# EAGLE design LMP2011basedV2 (EAGLE 8.5.1)
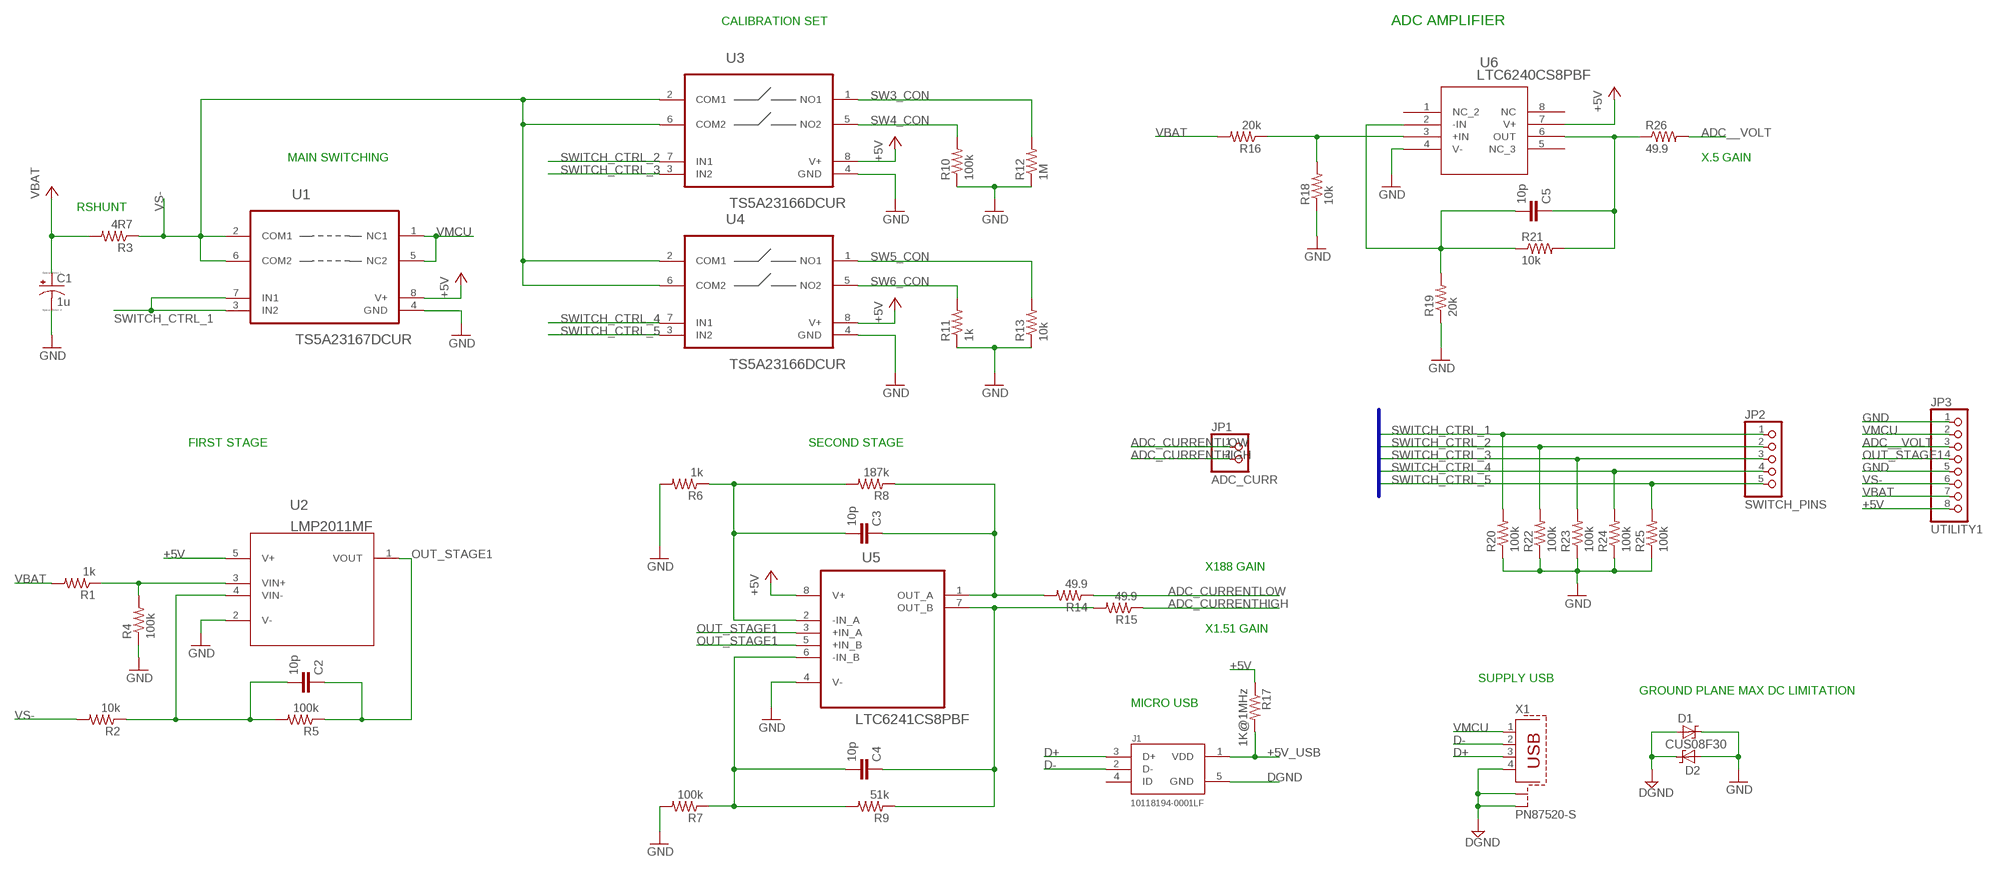
[diagram p0: schematic, sheet 1]

## Parts
C1  1u  CPOL-USB  [PANASONIC_B]
C2  10p  C-EUC0805  [C0805]
C3  10p  C-EUC0805  [C0805]
C4  10p  C-EUC0805  [C0805]
C5  10p  C-EUC0805  [C0805]
D1  CUS08F30  [SOD323]
D2  CUS08F30  [SOD323]
J1  10118194-0001LF  [FRAMATOME_10118194-0001LF]
JP1  ADC_CURR  PINHD-1X2  [1X02]
JP2  SWITCH_PINS  PINHD-1X5  [1X05]
JP3  UTILITY1  PINHD-1X8  [1X08]
R1  1k  R-US_R0805  [R0805]
R2  10k  R-US_R0805  [R0805]
R3  4R7  R-US_R0805  [R0805]
R4  100k  R-US_R0805  [R0805]
R5  100k  R-US_R0805  [R0805]
R6  1k  R-US_R0805  [R0805]
R7  100k  R-US_R0805  [R0805]
R8  187k  R-US_R0805  [R0805]
R9  51k  R-US_R0805  [R0805]
R10  100k  R-US_R0805  [R0805]
R11  1k  R-US_R0805  [R0805]
R12  1M  R-US_R0805  [R0805]
R13  10k  R-US_R0805  [R0805]
R14  49.9  R-US_R0805  [R0805]
R15  49.9  R-US_R0805  [R0805]
R16  20k  R-US_R0805  [R0805]
R17  1K@1MHz  R-US_R0805  [R0805]
R18  10k  R-US_R0805  [R0805]
R19  20k  R-US_R0805  [R0805]
R20  100k  R-US_R0805  [R0805]
R21  10k  R-US_R0805  [R0805]
R22  100k  R-US_R0805  [R0805]
R23  100k  R-US_R0805  [R0805]
R24  100k  R-US_R0805  [R0805]
R25  100k  R-US_R0805  [R0805]
R26  49.9  R-US_R0603  [R0603]
U1  TS5A23167DCUR  [SOP50P310X90-8N]
U2  LMP2011MF  [SOT95P285X120-5N]
U3  TS5A23166DCUR  [SOP50P310X90-8N]
U4  TS5A23166DCUR  [SOP50P310X90-8N]
U5  LTC6241CS8PBF  [SOIC127P600X175-8N]
U6  LTC6240CS8PBF  [SO-8_S]
X1  PN87520-S  [PN87520-S]

## Nets
+5V: JP3.8 R17.1 U1.8(V+) U2.5(V+) U3.8(V+) U4.8(V+) U5.8(V+) U6.7(V+)
+5V_USB: J1.1(VDD) R17.2
ADC__VOLT: JP3.3 R26.2
ADC_CURRENTHIGH: JP1.2 R15.1
ADC_CURRENTLOW: JP1.1 R14.1
D+: J1.3(D+) X1.3
D-: J1.2(D-) X1.2
DGND: D1.A D2.C J1.5(GND) X1.4 X1.S1 X1.S2
GND: C1.- D1.C D2.A JP3.1 JP3.5 R4.1 R6.2 R7.2 R10.1 R11.1 R12.1 R13.1 R18.1 R19.1 R20.1 R22.1 R23.1 R24.1 R25.1 U1.4(GND) U2.2(V-) U3.4(GND) U4.4(GND) U5.4(V-) U6.4(V-)
N$1: R16.1 R18.2 U6.3(+IN)
N$2: C5.1 R21.2 R26.1 U6.6(OUT)
N$4: C5.2 R19.2 R21.1 U6.2(-IN)
N$7: C3.1 R8.1 R14.2 U5.1(OUT_A)
N$10: C2.2 R2.1 R5.2 U2.4(VIN-)
N$11: C4.1 R9.1 R15.2 U5.7(OUT_B)
N$12: R1.1 R4.2 U2.3(VIN+)
N$13: C3.2 R6.1 R8.2 U5.2(-IN_A)
N$15: C4.2 R7.1 R9.2 U5.6(-IN_B)
OUT_STAGE1: C2.1 JP3.4 R5.1 U2.1(VOUT) U5.3(+IN_A) U5.5(+IN_B)
SW3_CON: R12.2 U3.1(NO1)
SW4_CON: R10.2 U3.5(NO2)
SW5_CON: R13.2 U4.1(NO1)
SW6_CON: R11.2 U4.5(NO2)
SWITCH_CTRL_1: JP2.1 R20.2 U1.3(IN2) U1.7(IN1)
SWITCH_CTRL_2: JP2.2 R22.2 U3.7(IN1)
SWITCH_CTRL_3: JP2.3 R23.2 U3.3(IN2)
SWITCH_CTRL_4: JP2.4 R24.2 U4.7(IN1)
SWITCH_CTRL_5: JP2.5 R25.2 U4.3(IN2)
VBAT: C1.+ JP3.7 R1.2 R3.2 R16.2
VMCU: JP3.2 U1.1(NC1) U1.5(NC2) X1.1
VS-: JP3.6 R2.2 R3.1 U1.2(COM1) U1.6(COM2) U3.2(COM1) U3.6(COM2) U4.2(COM1) U4.6(COM2)
Unconnected: J1.4(ID) U6.1(NC_2) U6.5(NC_3) U6.8(NC)

## Buses
SWITCH_CTRL_[1..6]

## Notes on the sheet
- CALIBRATION SET | ADC AMPLIFIER
- MAIN SWITCHING | X.5 GAIN
- RSHUNT
- FIRST STAGE | SECOND STAGE
- X188 GAIN
- X1.51 GAIN
- SUPPLY USB
- GROUND PLANE MAX DC LIMITATION
- MICRO USB

## Library data of the parts
C1 = resistor:CPOL-US: POLARIZED CAPACITOR, American symbol
C2-C5 = resistor:C-EU: CAPACITOR, European symbol
D1 D2 = CUS08F30:CUS08F30: http://octopart.com/1n4148ws-v-gs08-vishay+semiconductor-40871699; DESCRIPTION: DIODE SCHOTTKY 30V 800MA USC, 220mV @ 10mA, SOD-23 OR SC-76; MF: TOSHIBA; MP: CUS08F30; PACKAGE: SOD-323 Vishay Semiconductor; PRICE: None
J1 = 10118194-0001LF:10118194-0001LF: Conn Micro USB Type B RCP 5 POS 0.65mm Solder RA SMD 5 Terminal 1 Port T/R; AVAILABILITY: Good; DESCRIPTION: Conn Micro USB Type B RCP 5 POS 0.65mm Solder RA SMD 5 Terminal 1 Port T/R; MF: Amphenol; MP: 10118194-0001LF; PACKAGE: DIP-4 FCI; PRICE: 0.24 USD
JP1 = pinhead:PINHD-1X2: PIN HEADER
JP2 = pinhead:PINHD-1X5: PIN HEADER
JP3 = pinhead:PINHD-1X8: PIN HEADER
R1-R26 = resistor:R-US_: RESISTOR, American symbol
U1 = TS5A2316XDCUR:TS5A23167DCUR: SPST ANALOG SWITCH; AVAILABILITY: Good; DESCRIPTION: 0.9-Ohm Dual SPST Analog Switch 5-V/3.3-V 2-Channel Analog Switch 8-VSSOP -40 to 85; MF: Texas Instruments; MP: TS5A23167DCUR; PACKAGE: VFSOP-8 Texas Instruments; PRICE: 0.46 USD
U2 = LMP2011MF:LMP2011MF: Rail-to-Rail Output Operational Amplifier; DESCRIPTION: IC OPAMP GP 3MHZ RRO SOT23-5; DIGI-KEY_PART_NUMBER: LMP2011MF/NOPBCT-ND; DIGI-KEY_PURCHASE_URL: https://www.digikey.com/product-detail/es/texas-instruments/LMP2011MF-NOPB/LMP2011MF-NOPBCT-ND/723480?WT.z_cid=ref_snapeda&utm_source=snapeda&utm_medium=aggregator&utm_campaign=buynow; MF: Texas Instruments; MP: LMP2011MF/NOPB; PACKAGE: SOT-23-5 Texas Instruments
U3 U4 = TS5A2316XDCUR:TS5A23166DCUR: SPST ANALOG SWITCH; AVAILABILITY: Good; DESCRIPTION: 0.9-Ohm Dual SPST Analog Switch 5-V/3.3-V 2-Channel Analog Switch 8-VSSOP -40 to 85; MF: Texas Instruments; MP: TS5A23166DCUR; PACKAGE: VFSOP-8 Texas Instruments; PRICE: 0.46 USD
U5 = LTC6241CS8PBF:LTC6241CS8PBF: Low Noise, Rail-to-Rail Output,CMOS Op Amps; AVAILABILITY: Good; DESCRIPTION: LTC6241 - Dual 18MHz, Low Noise, Rail-to-Rail Output, CMOS Op Amp; MF: Linear Technology; MP: LTC6241CS8#PBF; PACKAGE: SO-8 Linear Technology; PRICE: 2.03 USD
U6 = LTC6240CS8PBF:LTC6240CS8PBF; AVAILABILITY: Good; DESCRIPTION: LTC6240 Op Amp CMOS R-R SOICN-8; MF: Linear Technology; MP: LTC6240CS8#PBF; PACKAGE: SOIC-8 Linear Technology; PRICE: 1.20 USD
X1 = con-berg:PN87520-S; OC_FARNELL: unknown; OC_NEWARK: unknown

## Board
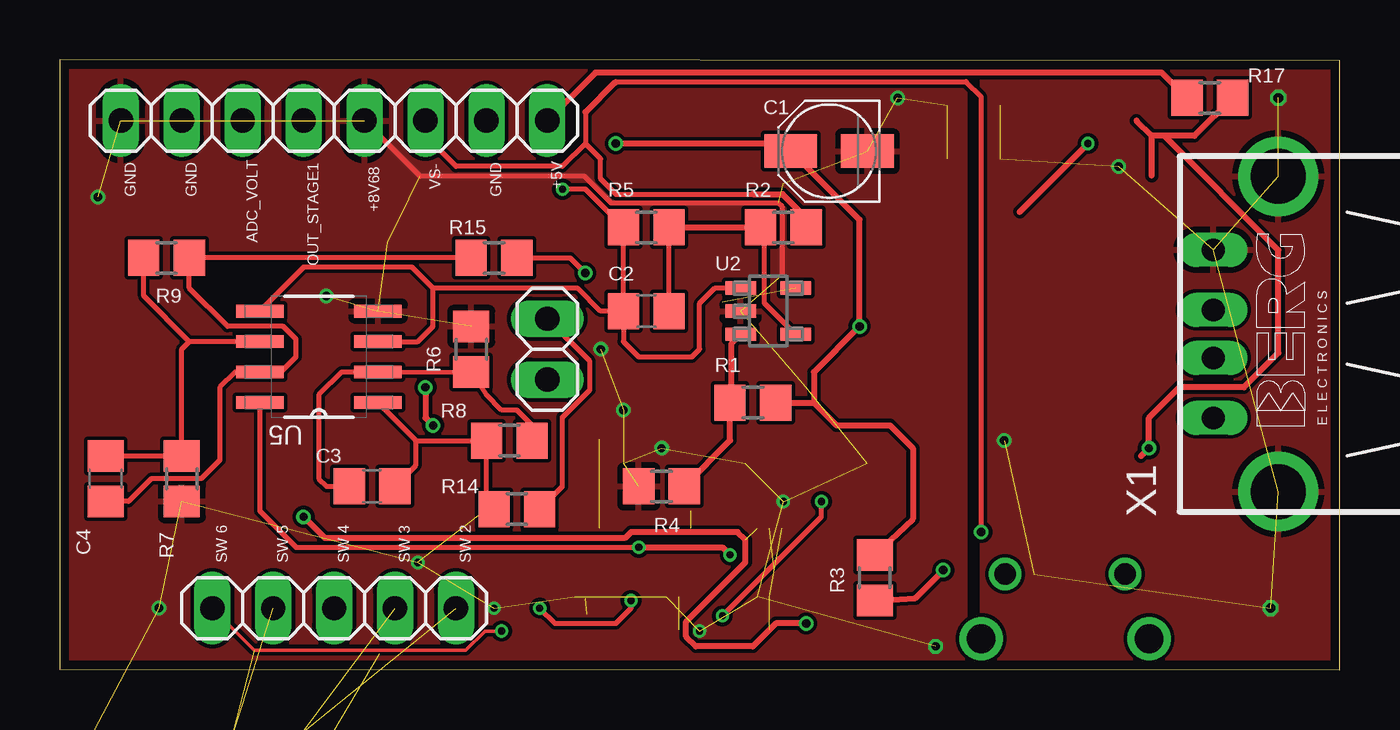
[diagram p1: board, top side]
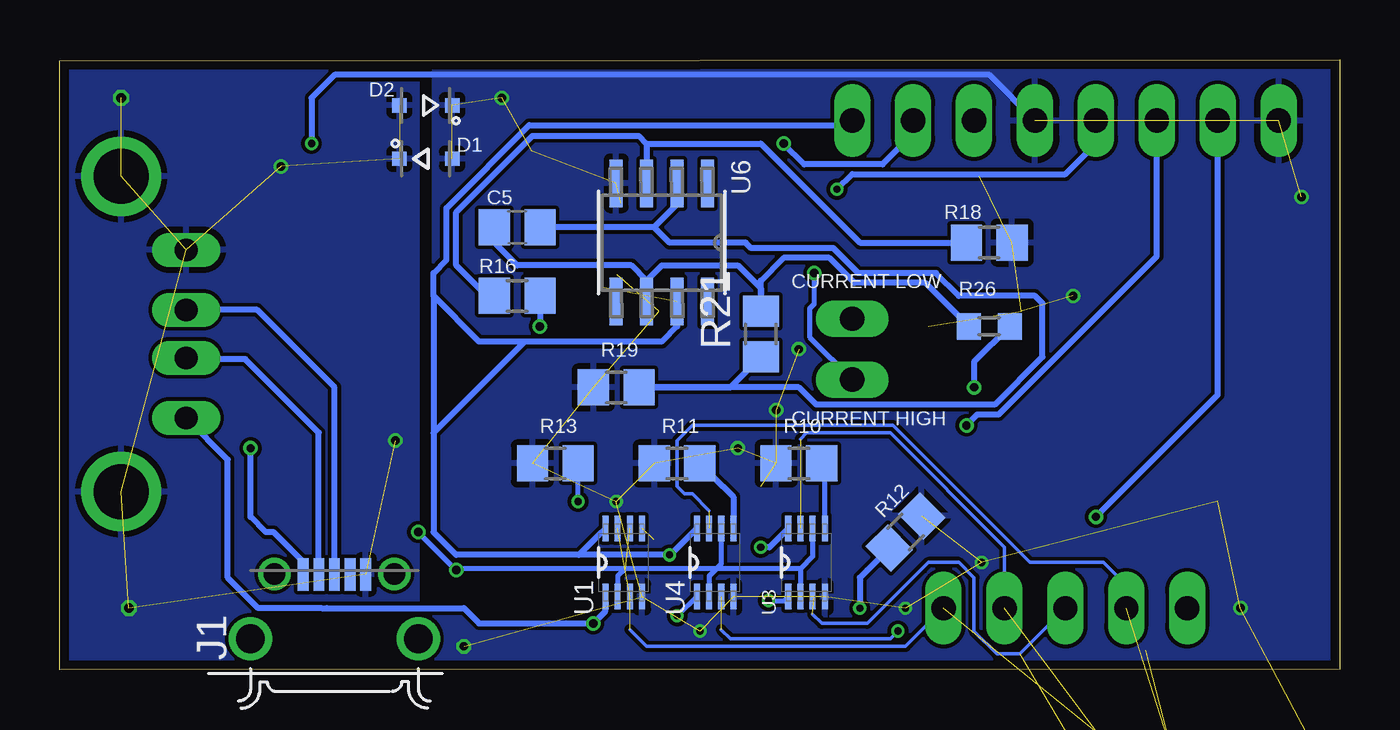
[diagram p2: board, bottom side, seen from below]

Size 53.35 x 25.41 mm. Coordinates in mm from the lower left corner, seen from the top.
Outline: 0,0.02 53.35,0 53.35,25.39 0,25.41 0,0.02
Copper layers (1*16): Top 0.035559375mm / dielectric 1.6mm / Bottom 0.035559375mm
Design rules "oshpark-2layer": minimum track width 6mil, minimum drill 10mil, track to track 6mil, track to pad 6mil, pad to pad 6mil, via to via 6mil, smd to smd 6mil, copper to edge 15mil, drill to drill 6mil, minimum pad ring 5mil, minimum via ring 5mil, stop-mask expansion 2.5mil, vias tented up to drill 0mil, thermal gap 10mil

### Footprints (pad centres in the part's own frame; a part is rotated, then mirrored left to right if it is on the bottom)
PANASONIC_B = smd 2.2 x 1.4: + 1.6,0; - -1.6,0
C0805 = smd 1.3 x 1.5: 1 -0.95,0; 2 0.95,0
SOD323 = smd 0.6 x 0.6: A 1.1,0; C -1.1,0
FRAMATOME_10118194-0001LF = smd 0.45 x 1.35: 1 -1.3,2.675; 2 -0.65,2.675; 3 0,2.675; 4 0.65,2.675; 5 1.3,2.675 | drill 0.9: P$6 -2.5,2.7; P$7 2.5,2.7 | drill 1.2: P$8 -3.5,0; P$9 3.5,0
1X02 = drill 1.016 long: 1 -1.27,0; 2 1.27,0
1X05 = drill 1.016 long: 1 -5.08,0; 2 -2.54,0; 3 0,0; 4 2.54,0; 5 5.08,0
1X08 = drill 1.016 long: 1 -8.89,0; 2 -6.35,0; 3 -3.81,0; 4 -1.27,0; 5 1.27,0; 6 3.81,0; 7 6.35,0; 8 8.89,0
R0805 = smd 1.3 x 1.5: 1 -0.95,0; 2 0.95,0
R0603 = smd 1 x 1.1: 1 -0.85,0; 2 0.85,0
SOP50P310X90-8N = smd 1.067 x 0.254: 1 -1.422,0.762; 2 -1.422,0.254; 3 -1.422,-0.254; 4 -1.422,-0.762; 5 1.422,-0.762; 6 1.422,-0.254; 7 1.422,0.254; 8 1.422,0.762
SOT95P285X120-5N = smd 1.27 x 0.559: 1 -1.143,0.965; 2 -1.143,0; 3 -1.143,-0.965; 4 1.143,-0.965; 5 1.143,0.965
SOIC127P600X175-8N = smd 1.981 x 0.533: 1 -2.464,1.905; 2 -2.464,0.635; 3 -2.464,-0.635; 4 -2.464,-1.905; 5 2.464,-1.905; 6 2.464,-0.635; 7 2.464,0.635; 8 2.464,1.905
SO-8_S = smd 1.981 x 0.533: 1 -2.464,1.905; 2 -2.464,0.635; 3 -2.464,-0.635; 4 -2.464,-1.905; 5 2.464,-1.905; 6 2.464,-0.635; 7 2.464,0.635; 8 2.464,1.905
PN87520-S = drill 0.95 long: 1 -3.5,2.71; 2 -1,2.71; 3 1,2.71; 4 3.5,2.71 | drill 2.3 pad 2.9: S1 -6.57,0; S2 6.57,0

### Placement (x,y rotation side)
C1  32.07,21.61 180 top
C2  24.45,14.95 0 top
C3  13.02,7.64 180 top
C4  1.91,7.96 90 top
C5  34.29,18.44 0 bottom
D1  38.1,23.52 180 bottom
D2  38.1,21.3 0 bottom
J1  41.91,1.29 0 bottom
JP1  20.32,13.36 270 top
JP2  11.43,2.56 180 top
JP3  11.43,22.88 0 top
R1  28.89,11.14 0 top
R2  30.16,18.44 0 top
R3  33.97,3.83 90 top
R4  25.08,7.64 0 top
R5  24.45,18.44 0 top
R6  17.14,13.36 90 top
R7  5.08,7.96 270 top
R8  18.73,9.55 0 top
R9  4.45,17.17 180 top
R10  22.54,8.6 0 bottom
R11  27.62,8.6 0 bottom
R12  18.1,5.74 225 bottom
R13  32.7,8.6 0 bottom
R14  19.05,6.69 180 top
R15  18.1,17.17 180 top
R16  34.29,15.58 0 bottom
R17  47.94,23.84 0 top
R18  14.61,17.8 180 bottom
R19  30.16,11.77 0 bottom
R20  -2.86,-12.36 0 top  (outside the outline)
R21  24.13,13.99 90 bottom
R22  -2.86,-18.71 0 top  (outside the outline)
R23  -2.86,-25.06 0 top  (outside the outline)
R24  -2.86,-31.41 0 top  (outside the outline)
R25  -2.86,-37.76 0 top  (outside the outline)
R26  14.61,14.31 0 bottom
U1  29.84,4.47 90 bottom
U2  29.53,14.95 0 top
U3  22.23,4.47 90 bottom
U4  26.04,4.47 90 bottom
U5  10.79,13.04 180 top
U6  28.26,17.8 270 bottom
X1  50.8,13.99 90 top

### Tracks (layer width: path | path; a pad name or v marks a point on that pad's centre or on a via)
+5V  (via drill 0.3)  (1 unrouted)
  Top 0.203: U5.8 8.33,6.61 9.84,5.1 v24.13,5.1
  Top 0.254: 44.77,24.89 | 44.77,24.89 42.55,24.89 22.32,24.89 JP3.8 | v24.13,5.1 27.62,5.1 v27.94,4.79 | R17.1 45.94,24.88 44.77,24.89
  Bottom 0.203: U1.8 30.78,5.72 | v27.94,4.79 31.71,4.79 36.83,4.79
  Bottom 0.254: 30.78,5.72 31.71,4.79 | U4.8 27.9,4.79 v27.94,4.79 36.83,4.79 37.78,5.74 37.78,9.86 | 37.78,15.58 37.78,9.86 | U3.8 23.77,5.1 v24.13,5.1 | U6.7 27.62,14.31 28.26,13.67 33.97,13.67 | 33.97,13.67 37.78,9.86 | 37.78,15.58 35.88,13.67 33.97,13.67 | 37.78,15.58 37.78,16.53 37.24,17.08 37.24,19.24 33.78,22.69 20.83,22.69 20.64,22.88 JP3.8
+5V_USB  (via drill 0.35)
  Top 0.254: 45.52,20.59 45.52,22.25 | 45.52,22.25 44.89,22.88 | 45.07,8.9 v45.4,9.23 45.4,10.5 46.67,11.77 49.37,11.77 50.8,13.2 50.8,17.48 46.04,22.25 | 46.04,22.25 45.52,22.25 | R17.2 47.3,22.25 46.04,22.25
  Bottom 0.254: J1.1 43.21,4.5 44.45,5.74 44.77,5.74 45.4,6.37 v45.4,9.23
ADC__VOLT  (via drill 0.35)
  Top 0.254: v15.24,11.77 15.24,10.5 v15.56,10.18
  Bottom 0.254: R26.2 15.24,12.83 v15.24,11.77 | v15.56,10.18 15.1,10.64 14.21,10.64 7.62,17.23 JP3.3
ADC_CURRENTHIGH  (via drill 0.35)
  Top 0.203: R15.1 21.27,17.17 v21.91,16.53
  Bottom 0.203: v21.91,16.53 21.91,15.24 22.1,15.05 22.1,13.87 JP1.2
ADC_CURRENTLOW
  Top 0.203: JP1.1 22.1,12.85 22.1,11.67 20.95,10.52 20.95,7.64 R14.1
D+
  Bottom 0.254: J1.3 41.91,11.77 45.13,14.99 X1.3
D-
  Bottom 0.254: X1.2 48.04,12.94 45.62,12.94 42.56,9.88 J1.2
DGND  (via drill 0.35, 0.4)  (9 unrouted)
  other vias: 50.48,2.56 50.8,23.84 39.37,9.55 44.13,20.98
  pour Bottom (rank 2): 38.42,0.02 53.34,0.02 53.34,25.42 38.42,25.42
  pour Top (rank 2): 38.42,0.02 53.34,0.02 53.34,25.42 38.42,25.42
GND  (via drill 0.3, 0.35)  (36 unrouted)
  Top 0.203: 30.12,16.46 30.12,19.29 29.97,19.44 23,19.44 21.88,20.56 15.03,20.56 JP3.5
  Top 0.254: 40.02,19.08 v42.86,21.93
  Bottom 0.254: JP3.5 14.61,24.79 41.91,24.79 42.86,23.83 v42.86,21.93
  other vias: 36.51,0.98 26.67,1.61 30.16,7.01 18.1,2.56 14.92,4.47 34.92,23.84 4.13,2.56 1.59,19.71 11.11,15.58 23.5,10.82 22.54,13.36 25.08,9.23
  pour Top (rank 2): 0,0.02 37.78,0.02 37.78,25.11 37.78,25.42 0,25.42
  pour Bottom (rank 2): 0,0.02 37.78,0.02 37.78,25.42 0,25.42
N$1
  Bottom 0.254: R16.1 35.24,15.26 36.83,16.85 36.83,19.07 33.66,22.25 29.21,22.25 28.89,21.93 | 28.89,21.93 U6.3 | 28.89,21.93 24.13,21.93 20,17.8 15.94,17.8 15.83,17.92 R18.2
N$2
  Bottom 0.254: U6.6 28.89,16.21 | 28.89,16.21 28.26,16.85 25.08,16.85 24.13,15.9 R21.2 24.13,16.21 23.18,17.17 21.27,17.17 20.23,16.13 17.27,16.13 R26.1 | 28.89,16.21 29.53,16.85 34.29,16.85 35.24,17.8 C5.1
N$4
  Bottom 0.254: R21.1 25.4,11.77 R19.2 22.54,11.77 21.82,11.05 14.38,11.05 12.38,13.04 12.38,15.26 12.7,15.58 15.88,15.58 16.83,16.53 20.06,16.53 21.1,17.57 24.54,17.57 24.77,17.8 27.94,17.8 28.57,18.44 | U6.2 27.62,19.39 28.57,18.44 | 28.57,18.44 C5.2
N$7
  Top 0.203: U5.1 14.85,9.55 | 14.85,9.55 R8.1 17.78,7.11 R14.2 | C3.1 14.85,8.52 14.85,9.55
N$10
  Top 0.203: 29.37,18.28 29.37,15.28 U2.4 | C2.2 R5.2
  Top 0.254: R5.2 R2.1 29.37,18.28
N$11
  Top 0.203: R15.2 R9.1 5.39,15.9 6.99,14.31 9.31,14.31 9.84,13.78 9.84,13.04 9.21,12.41 U5.7 7.3,12.41 6.67,11.77 6.67,8.74 5.89,7.96 3.81,7.96 2.86,7.01 C4.1
N$12
  Top 0.254: R4.2 27.94,9.55 R1.1 28.01,11.2 28.01,13.61 U2.3
N$13
  Top 0.203: R8.2 19.68,10.18 19.05,10.82 18.41,10.82 17.78,11.45 R6.1 U5.2 11.75,12.41 10.79,11.45 10.79,7.96 11.11,7.64 C3.2
N$15
  Top 0.203: C4.2 R7.1 5.08,13.36 5.4,13.67 | U5.6 5.4,13.67 | R9.2 3.5,15.58 5.4,13.67
OUT_STAGE1  (via drill 0.3)
  Top 0.203: C2.1 R5.1 21.91,20.03 v20.95,20.03 | C2.1 23.5,13.68 23.5,13.67 24.13,13.04 26.35,13.04 26.67,13.36 26.67,15.26 27.32,15.91 U2.1 | U5.5 10.16,16.77 14.68,16.77 15.56,15.9 | U5.3 14.92,13.67 15.56,14.31 15.56,15.9 | 15.56,15.9 21.59,15.9 22.55,14.94 C2.1
  Top 0.254: v20.96,20.03 v20.95,20.03 | R5.1 23.5,17.8
  Bottom 0.254: v20.95,20.03 20.32,20.66 11.43,20.66 10.16,21.93 JP3.4
SW3_CON  (via drill 0.3)
  Top 0.203: v20,2.56 20.64,1.93 23.18,1.93 23.81,2.56 v23.81,2.88
  Bottom 0.203: v20,2.56 20,2.88 | 19.68,4.15 R12.2 | v23.81,2.88 23.15,2.88 U3.1
  Bottom 0.254: R12.2 19.68,4.15 | 19.68,4.15 | 19.68,4.15 20,3.83 v20,2.56
SW4_CON
  Bottom 0.203: U3.5 21.46,8.47 R10.2
SW5_CON  (via drill 0.3)
  Top 0.203: v27.62,2.25 31.75,6.37 v31.75,7.01
  Bottom 0.203: U4.1 27.6,2.25 v27.62,2.25 | v31.75,7.01 R13.2
SW6_CON
  Bottom 0.203: 25.27,6.37 U4.5 | 25.72,7.64 R11.2
  Bottom 0.254: R11.2 25.72,7.64 25.27,7.2 25.27,6.37
SWITCH_CTRL_1  (3 unrouted)
  Bottom 0.152: 29.59,1.67 28.89,0.98 18.1,0.98 17.78,1.29 JP2.1
SWITCH_CTRL_2  (2 unrouted)
  Bottom 0.152: 22.48,9.61 22.23,9.86 18.73,9.86 13.97,5.1 JP2.2
SWITCH_CTRL_3  (2 unrouted)
  Bottom 0.152: U3.3 21.91,2.98 | JP2.3 13.34,0.66 14.29,0.66 15.24,1.61 15.24,3.83 15.88,4.47 17.14,4.47 19.68,1.93 21.59,1.93 21.97,2.31
SWITCH_CTRL_4  (2 unrouted)
  Bottom 0.152: 26.29,6.63 26.99,7.33 27.3,7.33 27.62,7.64 27.62,9.55 26.99,10.18 18.62,10.18 12.9,4.47 9.84,4.47 8.89,3.52 JP2.4
SWITCH_CTRL_5  (via drill 0.3)  (2 unrouted)
  Top 0.152: v18.41,1.61 17.72,1.61 16.92,0.81 8.1,0.81 JP2.5
  Bottom 0.152: 25.78,1.67 25.4,1.29 18.73,1.29 v18.41,1.61
VBAT  (via drill 0.35)
  Top 0.254: R1.2 31.43,11.14 | 31.43,11.14 32.38,10.18 34.61,10.18 35.56,9.23 35.56,6.27 R3.2 | 31.43,11.14 31.43,12.41 v33.34,14.31 33.34,18.76 C1.+ 30.15,21.93 v23.18,21.93
  Bottom 0.254: R16.2 v33.34,14.31 | v23.18,21.93 22.31,21.07 19.05,21.07 17.78,22.34 JP3.7
VMCU  (via drill 0.35)  (1 unrouted)
  Top 0.254: v31.11,1.93 29.84,1.93 28.89,0.98 26.52,0.98 26.11,1.38 26.11,2.01 28.57,4.47 28.57,5.42 28.26,5.74 23.81,5.74 23.56,5.48 11.05,5.48 v10.16,6.37
  Bottom 0.254: U1.1 30.61,2.44 v31.11,1.93 35.88,1.93 36.51,2.56 42.23,2.56 42.45,2.56 45.09,2.56 46.35,3.83 46.35,8.76 X1.1 | v10.16,6.37 5.08,11.45 JP3.2
VS-  (via drill 0.35)  (1 unrouted)
  Top 0.203: v38.42,5.74 38.42,23.87 37.78,24.51 23.18,24.51 21.91,23.24 21.91,21.93 | JP3.6 15.24,22.25 16.51,20.98 20.95,20.98 21.91,21.93 | 23.15,19.82 23.18,19.82 | 23.18,19.82 22.54,20.46 22.54,21.3 21.91,21.93 | 23.18,19.82 28.89,19.82
  Top 0.254: 31.11,19.07 R2.2 31.11,18.84 30.13,19.82 28.89,19.82 | R3.1 35.66,2.98 v36.83,4.15 | 21.91,23.24 23.15,24.48 23.18,24.48
  Bottom 0.203: U3.6 21.97,4.72 22.48,4.21 | 22.48,4.21 U3.2 | 22.48,4.21 25.97,4.21 | U4.2 26.29,3.9 25.97,4.21 | U4.6 25.78,4.4 25.97,4.21 | 25.97,4.21 29.78,4.21 | U1.2 30.1,3.9 29.78,4.21 | v38.42,5.74 36.89,4.21 29.78,4.21
  Bottom 0.254: v36.83,4.15 36.89,4.21

### Text on the board
tPlace: GND | GND | VS- | GND | +5V | +8V68 | ADC_VOLT | OUT_STAGE1 | SW 6 | SW 5 | SW 4 | SW 3 | SW 2
bPlace: CURRENT LOW | CURRENT HIGH